# Altium project Radio_Unit.PrjPcb
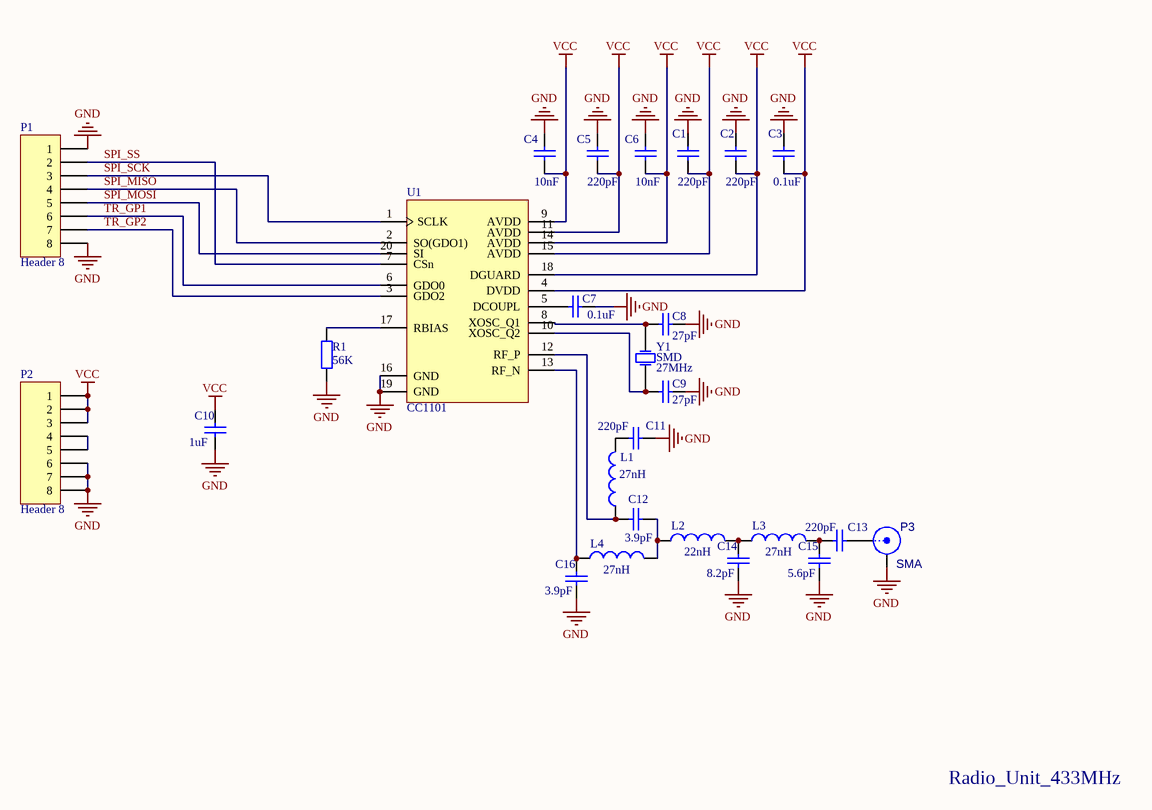
[diagram p0: Radio_Unit.SchDoc]
1 sheet, 26 parts. Net scope: global (net labels, ports and power ports of the same name join across sheets).
Board file: Radio_Unit.PcbDoc

## Sheet Radio_Unit.SchDoc
size A4

### Parts
C1  value 220pF  [C0603]  (hidden comment: 0805)
C2  value 220pF  [C0603]  (hidden comment: 0805)
C3  value 0.1uF  [C0603]  (hidden comment: 0805)
C4  value 10nF  [C0603]  (hidden comment: 0805)
C5  value 220pF  [C0603]  (hidden comment: 0805)
C6  value 10nF  [C0603]  (hidden comment: 0805)
C7  value 0.1uF  [C0603]  (hidden comment: 0805)
C8  value 27pF  [C0603]  (hidden comment: 0805)
C9  value 27pF  [C0603]  (hidden comment: 0805)
C10  value 1uF  [C0603]  (hidden comment: 0805)
C11  value 220pF  [C0603]  (hidden comment: 0805)
C12  value 3.9pF  [C0603]  (hidden comment: 0805)
C13  value 220pF  [C0603]  (hidden comment: 0805)
C14  value 8.2pF  [C0603]  (hidden comment: 0805)
C15  value 5.6pF  [C0603]  (hidden comment: 0805)
C16  value 3.9pF  [C0603]  (hidden comment: 0805)
L1  value 27nH  [L0603]  (hidden comment: SMD)
L2  value 22nH  [L0603]  (hidden comment: SMD)
L3  value 27nH  [L0603]  (hidden comment: SMD)
L4  value 27nH  [L0603]  (hidden comment: SMD)
P1  Header 8  [HDR1X8]
P2  Header 8  [HDR1X8]
P3  SMA  [SMA]
R1  value 56K  [C0603]  (hidden comment: RES)
U1  CC1101  [VQFN20]
Y1  SMD  [Quartz_SMD0603]

### Nets
GND: C1.1 C2.1 C3.1 C4.1 C5.1 C6.1 C7.2 C8.2 C9.2 C10.2 C11.2 C14.1 C15.1 C16.1 P1.1 P1.8 P2.6 P2.7 P2.8 P3.2(Y) R1.1 U1.16(GND) U1.19(GND)
VCC: C1.2 C2.2 C3.2 C4.2 C5.2 C6.2 C10.1 P2.1 P2.2 P2.3 U1.4(DVDD) U1.9(AVDD) U1.11(AVDD) U1.14(AVDD) U1.15(AVDD) U1.18(DGUARD)
SPI_MISO: P1.4 U1.2(SO(GDO1))
SPI_MOSI: P1.5 U1.20(SI)
SPI_SCK: P1.3 U1.1(SCLK)
SPI_SS: P1.2 U1.7(CSn)
TR_GP1: P1.6 U1.6(GDO0)
TR_GP2: P1.7 U1.3(GDO2)
NetC7_1: C7.1 U1.5(DCOUPL)
NetC8_1: C8.1 U1.8(XOSC_Q1) Y1.1(OSC1)
NetC9_1: C9.1 U1.10(XOSC_Q2) Y1.3(OSC2)
NetC11_1: C11.1 L1.2
NetC12_1: C12.1 L2.1 L4.2
NetC12_2: C12.2 L1.1 U1.12(RF_P)
NetC13_1: C13.1 C15.2 L3.2
NetC13_2: C13.2 P3.1(X)
NetC14_2: C14.2 L2.2 L3.1
NetC16_2: C16.2 L4.1 U1.13(RF_N)
NetP2_4: P2.4 P2.5
NetR1_2: R1.2 U1.17(RBIAS)

### Notes on the sheet
- Radio_Unit_433MHz
- (in symbol Quartz_SMD) 27MHz

### Library data of the parts
C1-C16 = Capasitor_SMD_0805: Capasitor_SMD_0808/
L1-L4 = Induktor_SMD
P1 P2 = Header 8: Header, 8-Pin; LatestRevisionDate: 17-Jul-2002; LatestRevisionNote: Re-released for DXP Platform.; Publisher: Altium Limited
R1 = RES: Resistor
Y1 = Quartz_SMD
P3 = SMA: LatestRevisionDate: 17-Jul-2002; Publisher: Altium Limited; LatestRevisionNote: Re-released for DXP Platform.; Value: *